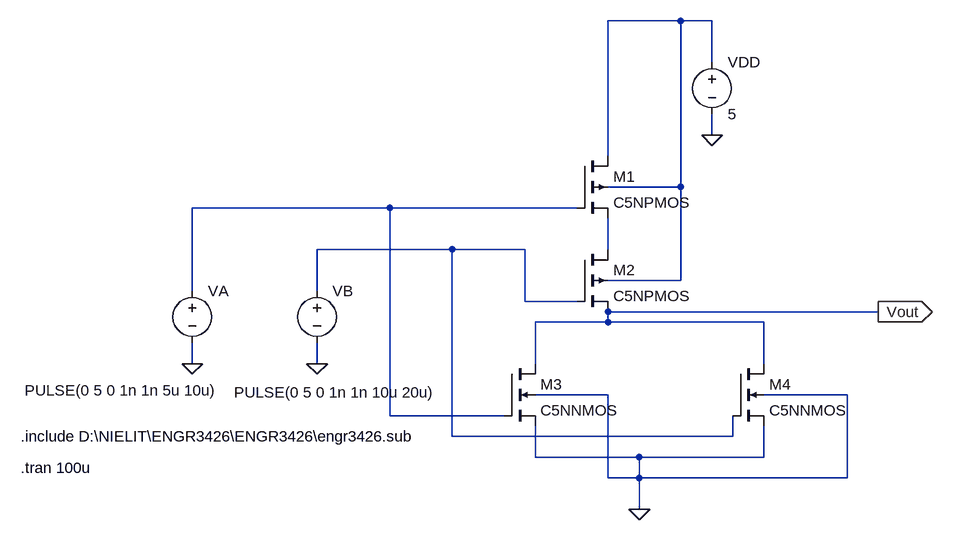
[diagram p0: schematic NOR.asc]
NOR.asc, the LTspice schematic file:
Version 4
SHEET 1 880 680
WIRE 320 -112 208 -112
WIRE 368 -112 320 -112
WIRE 368 -48 368 -112
WIRE 368 64 368 32
WIRE 208 96 208 -112
WIRE 320 144 320 -112
WIRE 320 144 208 144
WIRE -128 176 -432 176
WIRE 160 176 -128 176
WIRE -32 240 -240 240
WIRE 80 240 -32 240
WIRE 208 240 208 192
WIRE 320 288 320 144
WIRE 320 288 208 288
WIRE -432 304 -432 176
WIRE -240 304 -240 240
WIRE 80 320 80 240
WIRE 160 320 80 320
WIRE 624 336 208 336
WIRE 208 352 208 336
WIRE 208 352 96 352
WIRE 448 352 208 352
WIRE -432 416 -432 384
WIRE -240 416 -240 384
WIRE 96 416 96 352
WIRE 448 416 448 352
WIRE 208 464 96 464
WIRE 576 464 448 464
WIRE -128 496 -128 176
WIRE 48 496 -128 496
WIRE -32 528 -32 240
WIRE 400 528 400 496
WIRE 400 528 -32 528
WIRE 96 560 96 512
WIRE 256 560 96 560
WIRE 448 560 448 512
WIRE 448 560 256 560
WIRE 208 592 208 464
WIRE 256 592 256 560
WIRE 256 592 208 592
WIRE 576 592 576 464
WIRE 576 592 256 592
WIRE 256 640 256 592
FLAG 368 64 0
FLAG -432 416 0
FLAG -240 416 0
FLAG 256 640 0
FLAG 624 336 Vout
IOPIN 624 336 Out
SYMBOL pmos4 160 96 R0
SYMATTR InstName M1
SYMATTR Value C5NPMOS
SYMATTR Value2 l=0.6u w=7.2u
SYMBOL pmos4 160 240 R0
SYMATTR InstName M2
SYMATTR Value C5NPMOS
SYMATTR Value2 l=0.6u w=7.2u
SYMBOL nmos4 48 416 R0
SYMATTR InstName M3
SYMATTR Value C5NNMOS
SYMATTR Value2 l=0.6u w=3.6u
SYMBOL nmos4 400 416 R0
SYMATTR InstName M4
SYMATTR Value C5NNMOS
SYMATTR Value2 l=0.6u w=3.6u
SYMBOL voltage -432 288 R0
WINDOW 3 -258 169 Left 2
WINDOW 123 0 0 Left 0
WINDOW 39 0 0 Left 0
SYMATTR InstName VA
SYMATTR Value PULSE(0 5 0 1n 1n 5u 10u)
SYMBOL voltage -240 288 R0
WINDOW 3 -128 172 Left 2
WINDOW 123 0 0 Left 0
WINDOW 39 0 0 Left 0
SYMATTR InstName VB
SYMATTR Value PULSE(0 5 0 1n 1n 10u 20u)
SYMBOL voltage 368 -64 R0
SYMATTR InstName VDD
SYMATTR Value 5
TEXT -696 576 Left 2 !.tran 100u
TEXT -696 528 Left 2 !.include D:\\NIELIT\\ENGR3426\\ENGR3426\\engr3426.sub

The netlist it stands for:
* NOR.asc
M1 N001 N002 N004 N001 C5NPMOS l=0.6u w=7.2u
M2 N004 N003 Vout N001 C5NPMOS l=0.6u w=7.2u
M3 Vout N002 0 0 C5NNMOS l=0.6u w=3.6u
M4 Vout N003 0 0 C5NNMOS l=0.6u w=3.6u
VA N002 0 PULSE(0 5 0 1n 1n 5u 10u)
VB N003 0 PULSE(0 5 0 1n 1n 10u 20u)
VDD N001 0 5
.model NMOS NMOS
.model PMOS PMOS
.lib standard.mos
.tran 100u
.include D:\NIELIT\ENGR3426\ENGR3426\engr3426.sub
.backanno
.end